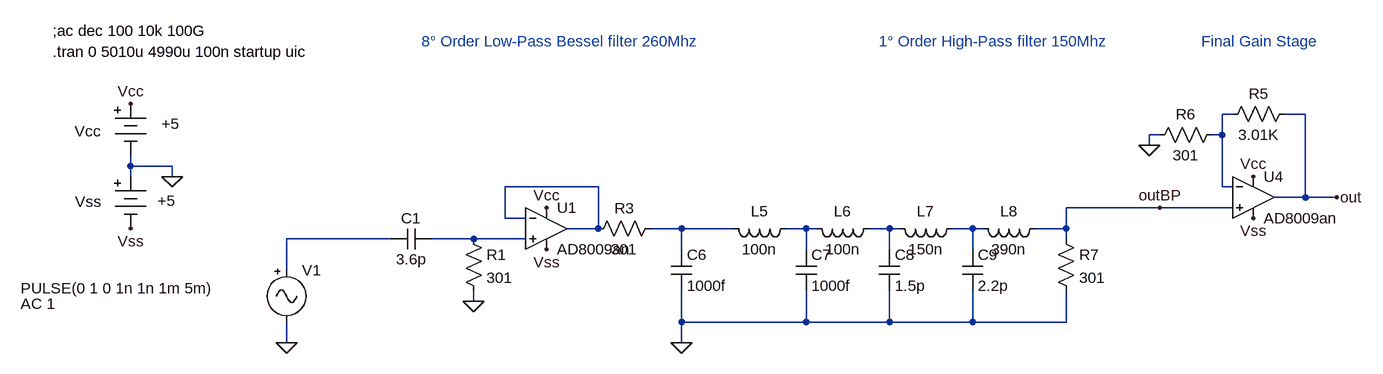
[diagram p0: schematic Real_Passive_8_LP_Bessel_1_HP.asc]
* Real_Passive_8_LP_Bessel_1_HP.asc
V1 N007 0 PULSE(0 1 0 1n 1n 1m 5m) AC 1
Vcc Vcc 0 +5
Vss 0 Vss +5
* U4: AD8009an (symbol AutoGenerated\AD8009an not available, pins judged from their places): In+=outBP In-=N001 V+=Vcc V-=Vss OUT=out
R5 out N001 3.01K tol=1 pwr=0.1
R6 N001 0 301 tol=1 pwr=0.1
R3 N003 N002 301 tol=1 pwr=0.1
C6 N003 0 1000f V=25 Irms=0 Rser=0 Lser=0 mfg="Murata" pn="GRM0335C1E1R0CA01" type="C0G"
L5 N004 N003 100n Ipk=4 Rser=0.015 Rpar=0 Cpar=0 mfg="Murata" pn="LQM2MPZR10MJHL"
L6 N005 N004 100n Ipk=4 Rser=0.015 Rpar=0 Cpar=0 mfg="Murata" pn="LQM2MPZR10MJHL"
L7 N006 N005 150n Ipk=6.2 Rser=0.012 Rpar=0 Cpar=0 mfg="Murata" pn="DFE201612PD-R15M=P2"
L8 outBP N006 390n Ipk=0.3 Rser=0.6 Rpar=36.738 Cpar=0 mfg="Coilcraft" pn="0402AF-391"
C7 N004 0 1000f V=25 Irms=0 Rser=0 Lser=0 mfg="Murata" pn="GRM0335C1E1R0CA01" type="C0G"
C8 N005 0 1.5p V=25 Irms=0 Rser=0 Lser=0 mfg="Murata" pn="GCM0335C1E1R5CA16" type="C0G"
C9 N006 0 2.2p V=16 Irms=0 Rser=0.374271 Lser=239.727p mfg="Würth Elektronik" pn="885012005021 WCAP-CSGP 0402" type="NP0"
R7 outBP 0 301 tol=1 pwr=0.1
C1 N008 N007 3.6p V=25 Irms=0 Rser=0 Lser=0 mfg="Murata" pn="GRM0335C1E3R6CA01" type="C0G"
R1 N008 0 301 tol=1 pwr=0.1
* U1: AD8009an (symbol AutoGenerated\AD8009an not available, pins judged from their places): In+=N008 In-=N002 V+=Vcc V-=Vss OUT=N002
;ac dec 100 10k 100G
.tran 0 5010u 4990u 100n startup uic
* 8° Order Low-Pass Bessel filter 260Mhz
* 1° Order High-Pass filter 150Mhz
* Final Gain Stage
.backanno
.end

* Results of the author's LTspice run, read from the files saved beside the schematic
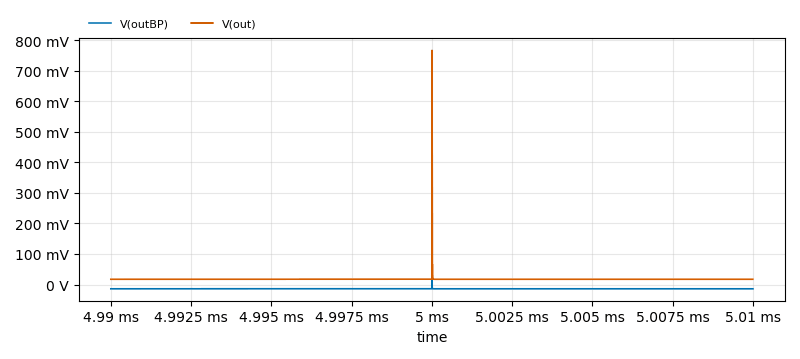
[diagram p1: Transient Analysis of Real_Passive_8_LP_Bessel_1_HP.asc, plotted from the saved traces]
* Transient Analysis, 1 run:
*   V(outBP): min -14.07 mV, max 145.6 mV, average -14.04 mV, rms 14.13 mV, last -14.07 mV
*   V(out): min 17.17 mV, max 767 mV, average 17.47 mV, rms 21.15 mV, last 17.17 mV